# Altium schematic sheet Test_Jig_BMP2.SchDoc
size A4; DrawnBy: Philip Rowse; CHECK: SAM K; CHECK_DATE: 1/2015; DOC_TITLE_1: MAGIA NEGRA PROBE V2.0; ENGR: JEFF W; ENG_DATE: 1/2015; MFG: JUAN V; MFG_DATE: 1/2015; QA: ALLAN G; QA_DATE: 1/2015; REV: X1; YEAR: 2015
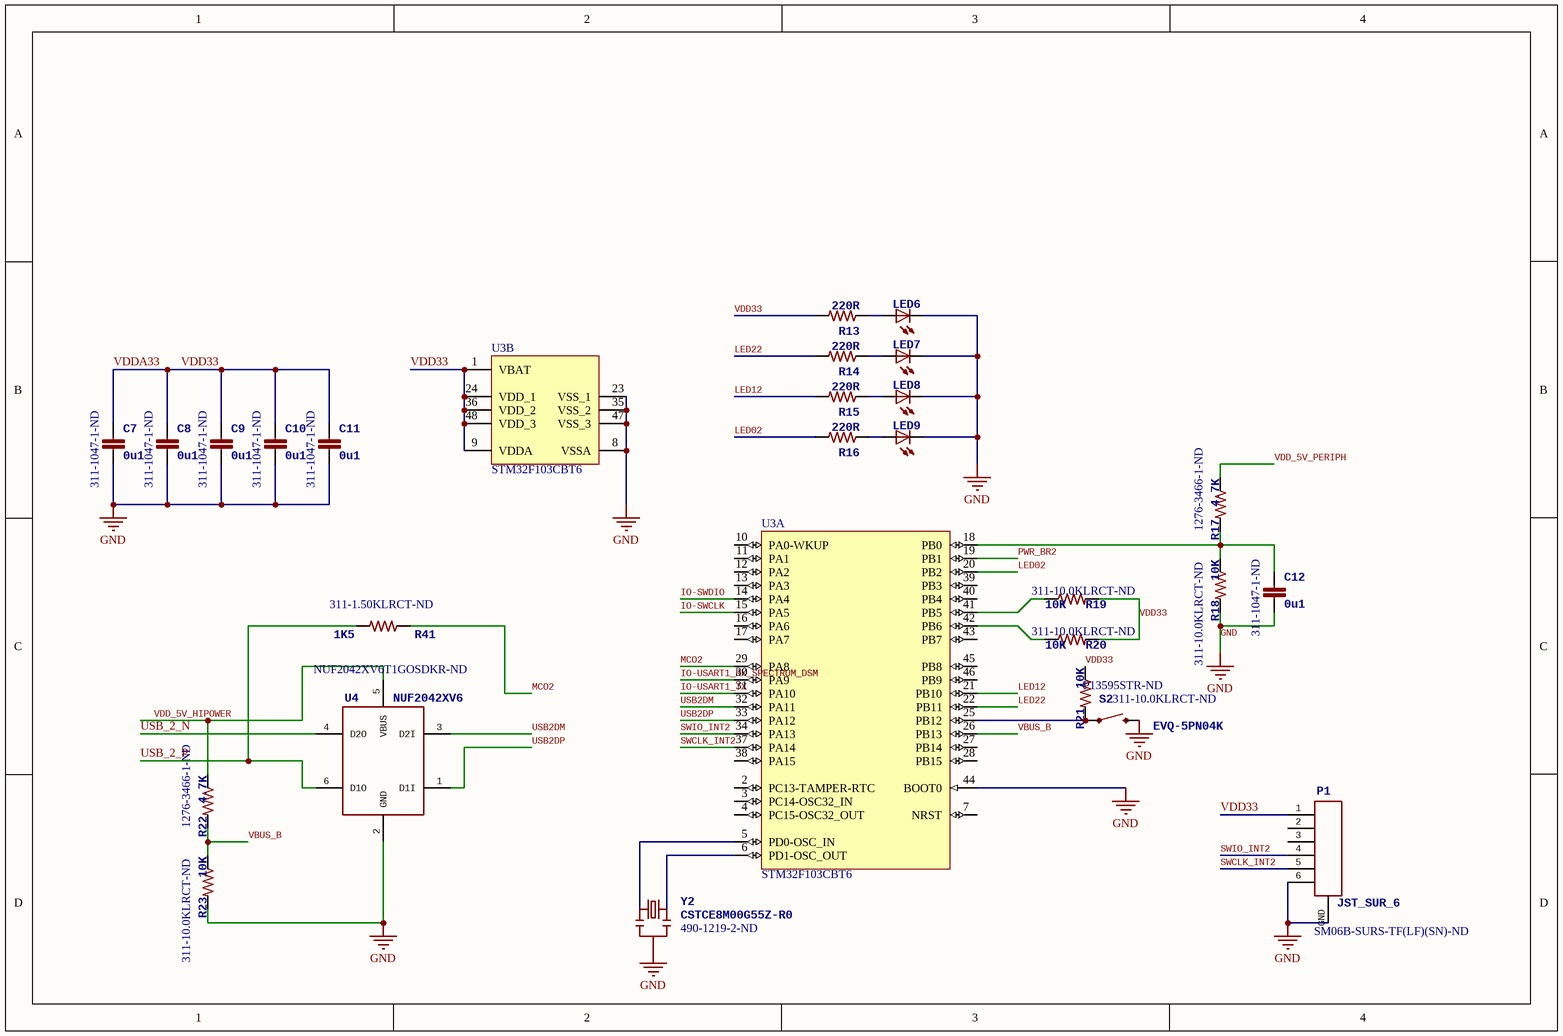
[diagram p0: Test_Jig_BMP2.SchDoc]

## Parts
C7  0u1  Supplier Part Number 1: 311-1047-1-ND  [0402-CAP]
C8  0u1  Supplier Part Number 1: 311-1047-1-ND  [0402-CAP]
C9  0u1  Supplier Part Number 1: 311-1047-1-ND  [0402-CAP]
C10  0u1  Supplier Part Number 1: 311-1047-1-ND  [0402-CAP]
C11  0u1  Supplier Part Number 1: 311-1047-1-ND  [0402-CAP]
C12  0u1  Supplier Part Number 1: 311-1047-1-ND  [0402-CAP]
LED6  LED0603_Green  [0603-LED-Blue]  (value not drawn)
LED7  LED0603_Green  [0603-LED-Blue]  (value not drawn)
LED8  LED0603_Green  [0603-LED-Blue]  (value not drawn)
LED9  LED0603_Green  [0603-LED-Blue]  (value not drawn)
P1  JST_SUR_6  Supplier Part Number 1: SM06B-SURS-TF(LF)(SN)-ND  [JST_SUR_H6]
R13  220R  [0402-RES]
R14  220R  [0402-RES]
R15  220R  [0402-RES]
R16  220R  [0402-RES]
R17  4.7K  Supplier Part Number 1: 1276-3466-1-ND  [0402-RES]
R18  10K  Supplier Part Number 1: 311-10.0KLRCT-ND  [0402-RES]
R19  10K  Supplier Part Number 1: 311-10.0KLRCT-ND  [0402-RES]
R20  10K  Supplier Part Number 1: 311-10.0KLRCT-ND  [0402-RES]
R21  10K  Supplier Part Number 1: 311-10.0KLRCT-ND  [0402-RES]
R22  4.7K  Supplier Part Number 1: 1276-3466-1-ND  [0402-RES]
R23  10K  Supplier Part Number 1: 311-10.0KLRCT-ND  [0402-RES]
R41  1K5  Supplier Part Number 1: 311-1.50KLRCT-ND  [0402-RES]
S2  EVQ-5PN04K  Supplier Part Number 1: P13595STR-ND  [TACTILE-SWITCH-1101NE]
U3  STM32F103CBT6  [STM-LQFP48_N]  (parts A,B of 2)
U4  NUF2042XV6  Supplier Part Number 1: NUF2042XV6T1GOSDKR-ND  [SOT563-6]
Y2  CSTCE8M00G55Z-R0  Supplier Part Number 1: 490-1219-2-ND  [RESONATOR-SMD]

## Nets
GND: C7.P$2 C8.P$2 C9.P$2 C10.P$2 C11.P$2 C12.P$2 LED6.C LED7.C LED8.C LED9.C P1.6 P1.GND R18.P$2 R23.P$2 S2.2 U3.8(VSSA) U3.23(VSS_1) U3.35(VSS_2) U3.44(BOOT0) U3.47(VSS_3) U4.2(GND) Y2.2
IO-SWCLK: U3.15(PA5)
IO-SWDIO: U3.14(PA4)
IO-USART1_RX_SPECTRUM_DSM: U3.30(PA9)
IO-USART1_TX: U3.31(PA10)
LED02: R16.P$2 U3.20(PB2)
LED12: R15.P$2 U3.21(PB10)
LED22: R14.P$2 U3.22(PB11)
MCO2: R41.P$1 U3.29(PA8)
PWR_BR2: U3.19(PB1)
SWCLK_INT2: P1.5 U3.37(PA14)
SWIO_INT2: P1.4 U3.34(PA13)
USB2DM: U3.32(PA11) U4.3(D2I)
USB2DP: U3.33(PA12) U4.1(D1I)
USB_2_N: U4.4(D2O)
USB_2_P: R41.P$2 U4.6(D1O)
VBUS_B: R22.P$2 R23.P$1 U3.26(PB13)
VDD33: C7.P$1 C8.P$1 C9.P$1 C10.P$1 C11.P$1 P1.1 R13.P$2 R19.P$2 R20.P$2 R21.P$1 U3.1(VBAT) U3.9(VDDA) U3.24(VDD_1) U3.36(VDD_2) U3.48(VDD_3)  [also labelled VDDA33]
VDD_5V_HIPOWER: R22.P$1 U4.5(VBUS)
VDD_5V_PERIPH: R17.P$1
NetC12_P$1: C12.P$1 R17.P$2 R18.P$1 U3.18(PB0)
NetLED6_A: LED6.A R13.P$1
NetLED7_A: LED7.A R14.P$1
NetLED8_A: LED8.A R15.P$1
NetLED9_A: LED9.A R16.P$1
NetR19_P$1: R19.P$1 U3.41(PB5)
NetR20_P$1: R20.P$1 U3.42(PB6)
NetR21_P$2: R21.P$2 S2.1 U3.25(PB12)
NetU3_5: U3.5(PD0-OSC_IN) Y2.1
NetU3_6: U3.6(PD1-OSC_OUT) Y2.3

Not connected (* = marked no-connect by the designer): P1 2 3; U3 2(PC13-TAMPER-RTC) 3(PC14-OSC32_IN) 4(PC15-OSC32_OUT) 7(NRST) 10(PA0-WKUP) 11(PA1) 12(PA2) 13(PA3) 16(PA6) 17(PA7) 27(PB14) 28(PB15) 38(PA15) 39(PB3) 40(PB4) 43(PB7) 45(PB8) 46(PB9)

## Library data of the parts
C7-C12 = CAP0402: CAP CER 0.1UF 16V Y5V 0402; PARTNO: CC0402ZRY5V7BB104; 3DR_PARTNO: ECM0700; Supplier 1: Digi-Key; Value: 0u1
LED6-LED9 = LED0603_Blue: LED GREEN ROUND CLEAR SMD; 3DR_PARTNO: ECM0494; PARTNO: APTD1608CGCK; Supplier 1: Digi-Key; Supplier Part Number 1: 754-1545-2-ND; Value: GREEN
P1 = JST_SUR_6: Connector, Header, 6Pos, .8mm IDC, R/A, SMD, Tin; 3DR_PARTNO: PRT0442; Supplier 1: Digi-Key
R13-R16 = RESISTOR0402-RES: RES 220 OHM 1/16W 1% 0402 SMD; PARTNO: RC0402FR-07220RL; 3DR_PARTNO: ECM0821; Supplier 1: Digi-Key; Supplier Part Number 1: 311-220LRCT-ND; Value: 220R
R17 R22 = RESISTOR0402-RES: RES 10K OHM 1/16W 1% 0402 SMD; PARTNO: RC1005F472CS; Value: 10K; Supplier 1: Digi-Key
R18-R21 R23 = RESISTOR0402-RES: RES 10K OHM 1/16W 1% 0402 SMD; PARTNO: RC0402FR-0710KL; 3DR_PARTNO: ECM0800; Supplier 1: Digi-Key; Value: 10K
R41 = RESISTOR0402-RES: RES 1.5K OHM 1/16W 1% 0402 SMD; PARTNO: RC0402FR-071K5L; 3DR_PARTNO: ECM0803; Supplier 1: Digi-Key; Value: 1K5
S2 = SWITCH-MOMENTARY-2-SMD-1101NE: Supplier 1: Digi-Key
U3 = STM32F103CBT6: ARM Cortex-M3 32-bit MCU, 128 KB Flash, 20 KB Internal RAM, 37 I/Os, 48-pin LQFP, -40 to 85 degC, Tray; A/D Converter: 2x12-bit (10 Channel); FLASH Size (Prog) (kB): 128; I/Os (High Current): 37; Internal RAM Size (kB): 20; Operating Frequency(F) (Processor speed) (MHz): 72; Supply Voltage(Vcc) min (V): 2; DatasheetVersion: Rev. 16; PackageVersion: Rev. 6, 06/2013; PackageReference: LQFP48; PackageDescription: 48-Pin Low Profile Quad Flat Package, 7 x 7 mm Body, 0.5 mm Pitch; Supplier 1: Digi-Key; Supplier Part Number 1: 497-6288-ND; Supplier 2: Farnell; Supplier Part Number 2: 1606327; Supplier 3: Newark; Supplier Part Number 3: 11N8296; Supplier 4: Newark; Supplier Part Number 4: 57P1214; Supplier 5: Mouser; Supplier Part Number 5: 511-STM32F103CBT6; Core: ARM Cortex-M3; Packing: Tray; Mounting Technology: Surface Mount; PartNumber: STM32F103CBT6; ComponentLink1Description: Manufacturer URL; ComponentLink1URL: http://www.st.com/web/en/home.html; ComponentLink2Description: Datasheet; ComponentLink2URL: http://www.st.com/st-web-ui/static/active/en/resource/technical/document/datasheet/CD00161566.pdf; ComponentLink3Description: Package Specification; ComponentLink3URL: http://www.st.com/st-web-ui/static/active/en/resource/technical/document/datasheet/DM00058181.pdf
U4 = NUF2042XV6: IC FILTER USB ESD PROTECT SOT363; PARTNO: NUF2042XV6T1G; 3DR_PARTNO: ECM0836; Supplier 1: Digi-Key
Y2 = RESONATORSMD: Supplier 1: Digi-Key